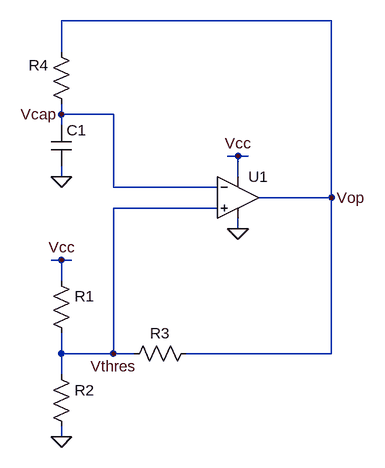
[diagram p0: schematic hysteresis_oscillator.asc]
hysteresis_oscillator.asc, the LTspice schematic file:
Version 4
SHEET 1 880 680
WIRE 352 -112 -64 -112
WIRE -64 -64 -64 -112
WIRE -64 32 -64 16
WIRE 16 32 -64 32
WIRE -64 48 -64 32
WIRE 208 96 192 96
WIRE 224 96 208 96
WIRE -64 128 -64 112
WIRE 208 128 208 96
WIRE 16 144 16 32
WIRE 176 144 16 144
WIRE 352 160 352 -112
WIRE 352 160 240 160
WIRE 176 176 16 176
WIRE 208 208 208 192
WIRE -64 256 -80 256
WIRE -48 256 -64 256
WIRE -64 288 -64 256
WIRE -64 400 -64 368
WIRE 16 400 16 176
WIRE 16 400 -64 400
WIRE 48 400 16 400
WIRE 352 400 352 160
WIRE 352 400 128 400
WIRE -64 432 -64 400
WIRE -64 528 -64 512
FLAG -64 128 0
FLAG -64 528 0
FLAG 208 208 0
FLAG -64 256 Vcc
FLAG 208 96 Vcc
FLAG 352 160 Vop
FLAG 16 400 Vthres
FLAG -64 32 Vcap
SYMBOL Opamps\\opamp2 208 96 R0
SYMATTR InstName U1
SYMATTR Value ""
SYMBOL res -80 272 R0
SYMATTR InstName R1
SYMATTR Value ""
SYMBOL res -80 416 R0
SYMATTR InstName R2
SYMATTR Value ""
SYMBOL res 144 384 R90
WINDOW 0 0 56 VBottom 2
WINDOW 3 32 56 VTop 2
SYMATTR InstName R3
SYMATTR Value ""
SYMBOL res -48 32 R180
WINDOW 0 36 76 Left 2
WINDOW 3 36 40 Left 2
SYMATTR InstName R4
SYMATTR Value ""
SYMBOL cap -80 48 R0
SYMATTR InstName C1
SYMATTR Value ""

The netlist it stands for:
* hysteresis_oscillator.asc
XU1 Vthres Vcap Vcc 0 Vop opamp2  ; pins In+ In- V+ V- OUT
R1 Vcc Vthres
R2 Vthres 0
R3 Vop Vthres
R4 Vcap Vop
C1 Vcap 0
.backanno
.end